# EAGLE design 64K SRAM Memory (EAGLE 7.5.0)
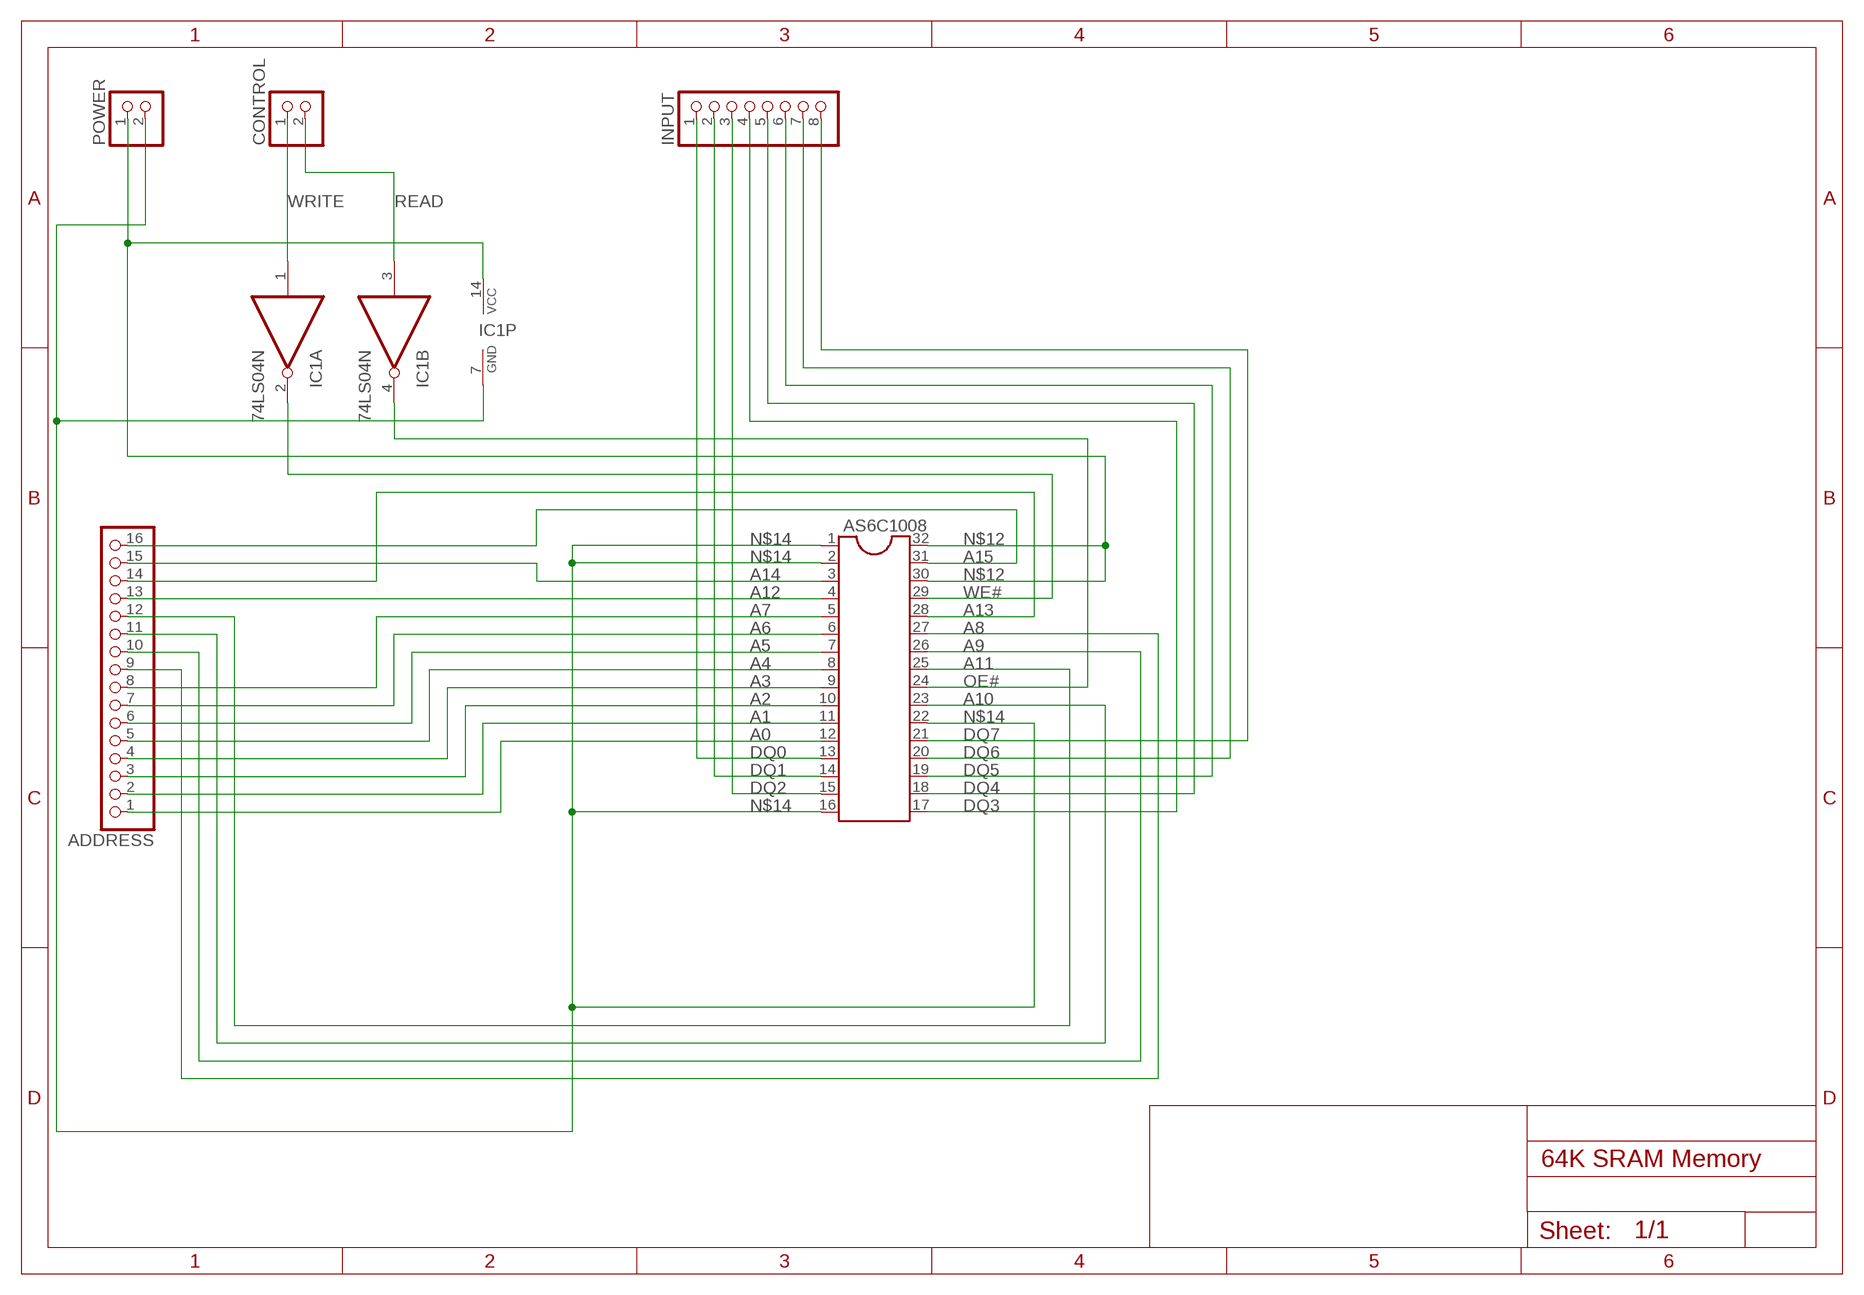
[diagram p0: schematic, sheet 1]

## Parts
ADDRESS  PINHD-1X16  [1X16]
AS6C1008  DIL32  [DIL32]
CONTROL  PINHD-1X2  [1X02]
IC1  74LS04N  [DIL14]
INPUT  PINHD-1X8  [1X08]
POWER  PINHD-1X2  [1X02]

## Nets
A0: ADDRESS.1 AS6C1008.12
A1: ADDRESS.2 AS6C1008.11
A2: ADDRESS.3 AS6C1008.10
A3: ADDRESS.4 AS6C1008.9
A4: ADDRESS.5 AS6C1008.8
A5: ADDRESS.6 AS6C1008.7
A6: ADDRESS.7 AS6C1008.6
A7: ADDRESS.8 AS6C1008.5
A8: ADDRESS.9 AS6C1008.27
A9: ADDRESS.10 AS6C1008.26
A10: ADDRESS.11 AS6C1008.23
A11: ADDRESS.12 AS6C1008.25
A12: ADDRESS.13 AS6C1008.4
A13: ADDRESS.14 AS6C1008.28
A14: ADDRESS.15 AS6C1008.3
A15: ADDRESS.16 AS6C1008.31
DQ0: AS6C1008.13 INPUT.1
DQ1: AS6C1008.14 INPUT.2
DQ2: AS6C1008.15 INPUT.3
DQ3: AS6C1008.17 INPUT.4
DQ4: AS6C1008.18 INPUT.5
DQ5: AS6C1008.19 INPUT.6
DQ6: AS6C1008.20 INPUT.7
DQ7: AS6C1008.21 INPUT.8
N$12: AS6C1008.30 AS6C1008.32 IC1.14(P:VCC) POWER.1
N$14: AS6C1008.1 AS6C1008.2 AS6C1008.16 AS6C1008.22 IC1.7(P:GND) POWER.2
OE#: AS6C1008.24 IC1.4(B:O)
READ: CONTROL.2 IC1.3(B:I)
WE#: AS6C1008.29 IC1.2(A:O)
WRITE: CONTROL.1 IC1.1(A:I)
Unconnected: IC1.5(C:I) IC1.6(C:O) IC1.8(D:O) IC1.9(D:I) IC1.10(E:O) IC1.11(E:I) IC1.12(F:O) IC1.13(F:I)

## Library data of the parts
ADDRESS = pinhead:PINHD-1X16: PIN HEADER
AS6C1008 = ic-package:DIL32: Dual In Line
CONTROL POWER = pinhead:PINHD-1X2: PIN HEADER
IC1 = 74xx-eu:74*04: Hex INVERTER
INPUT = pinhead:PINHD-1X8: PIN HEADER

## Board
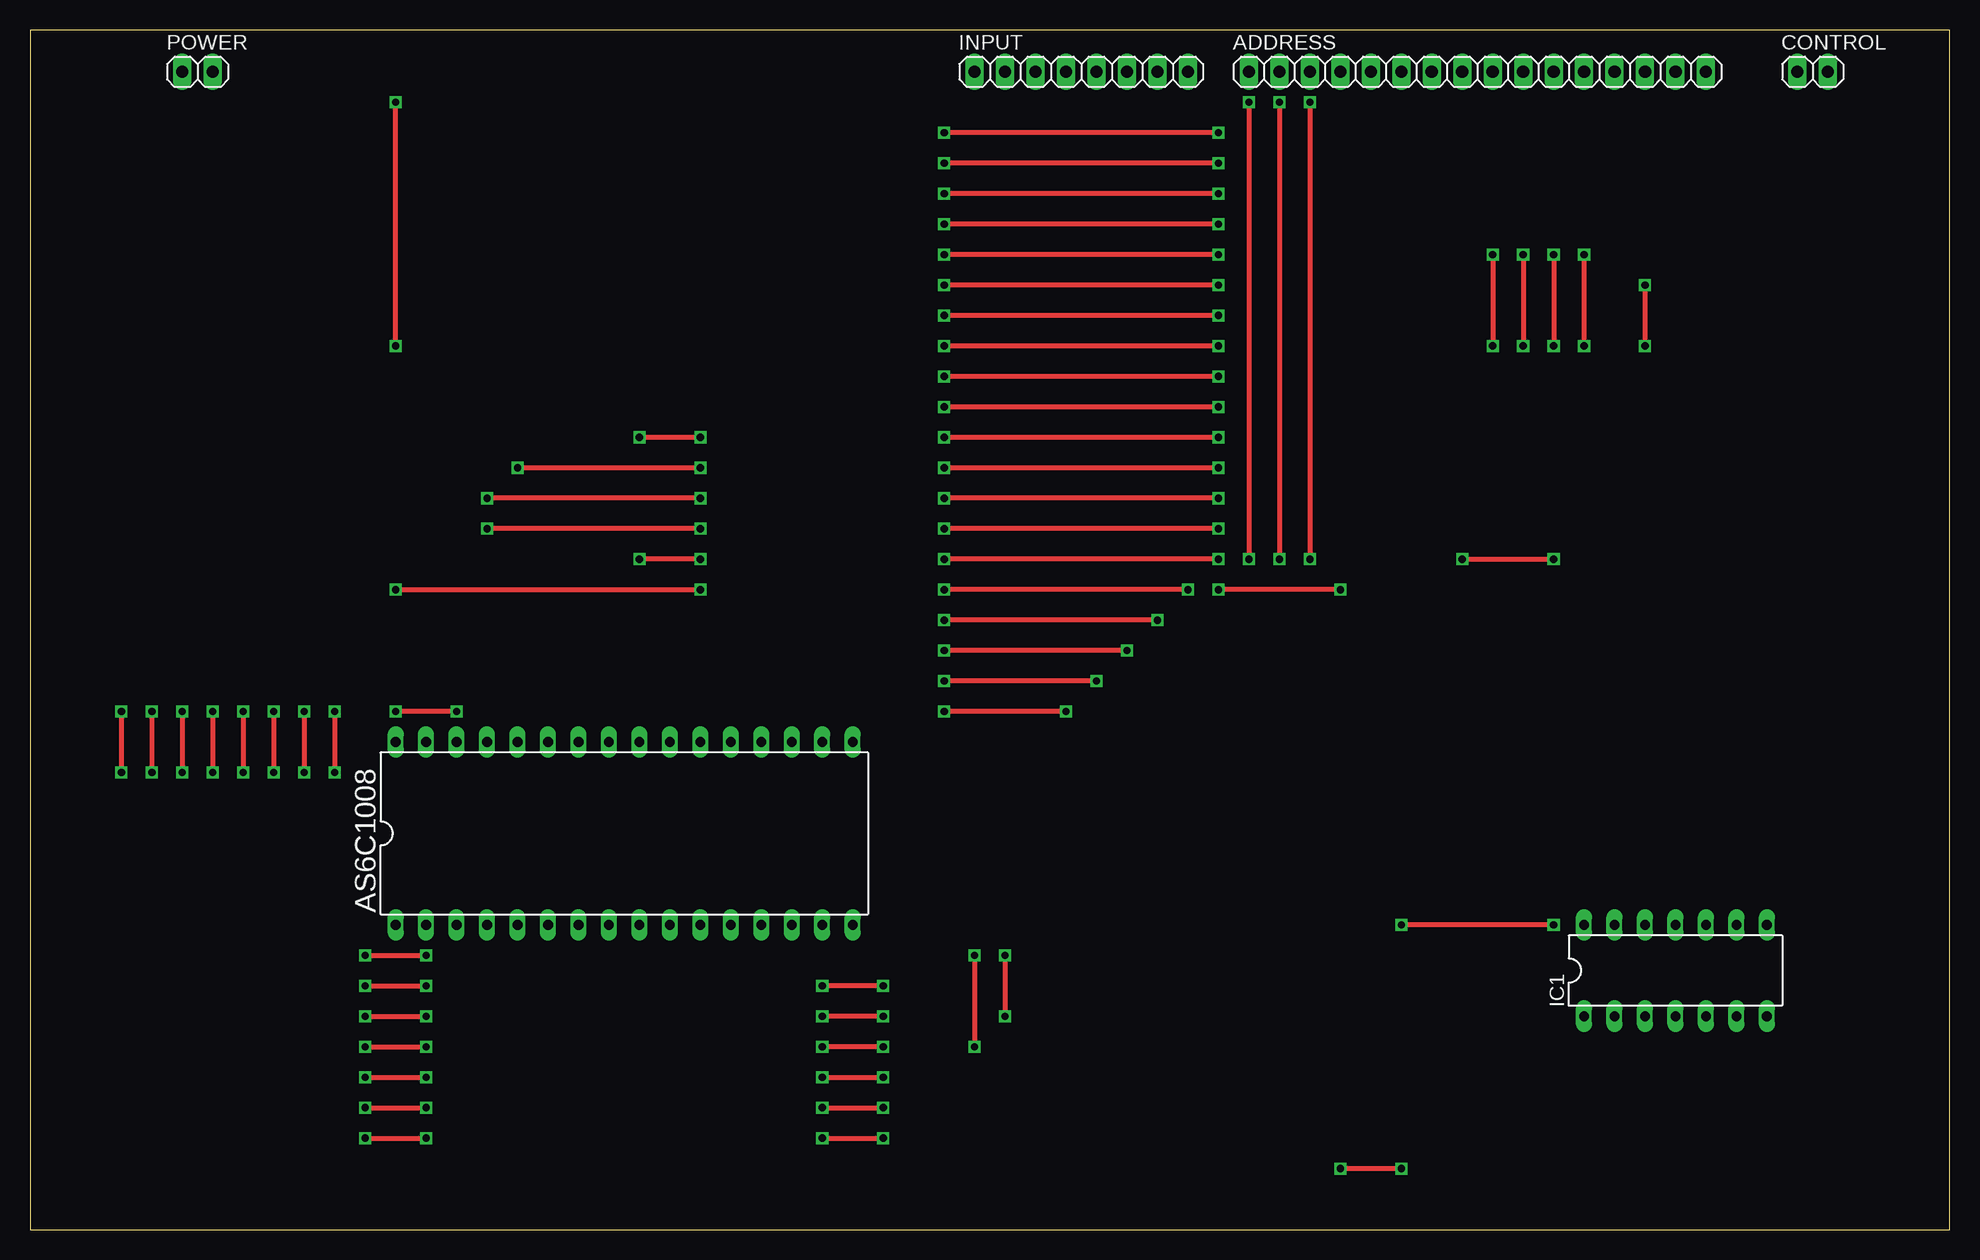
[diagram p1: board, top side]
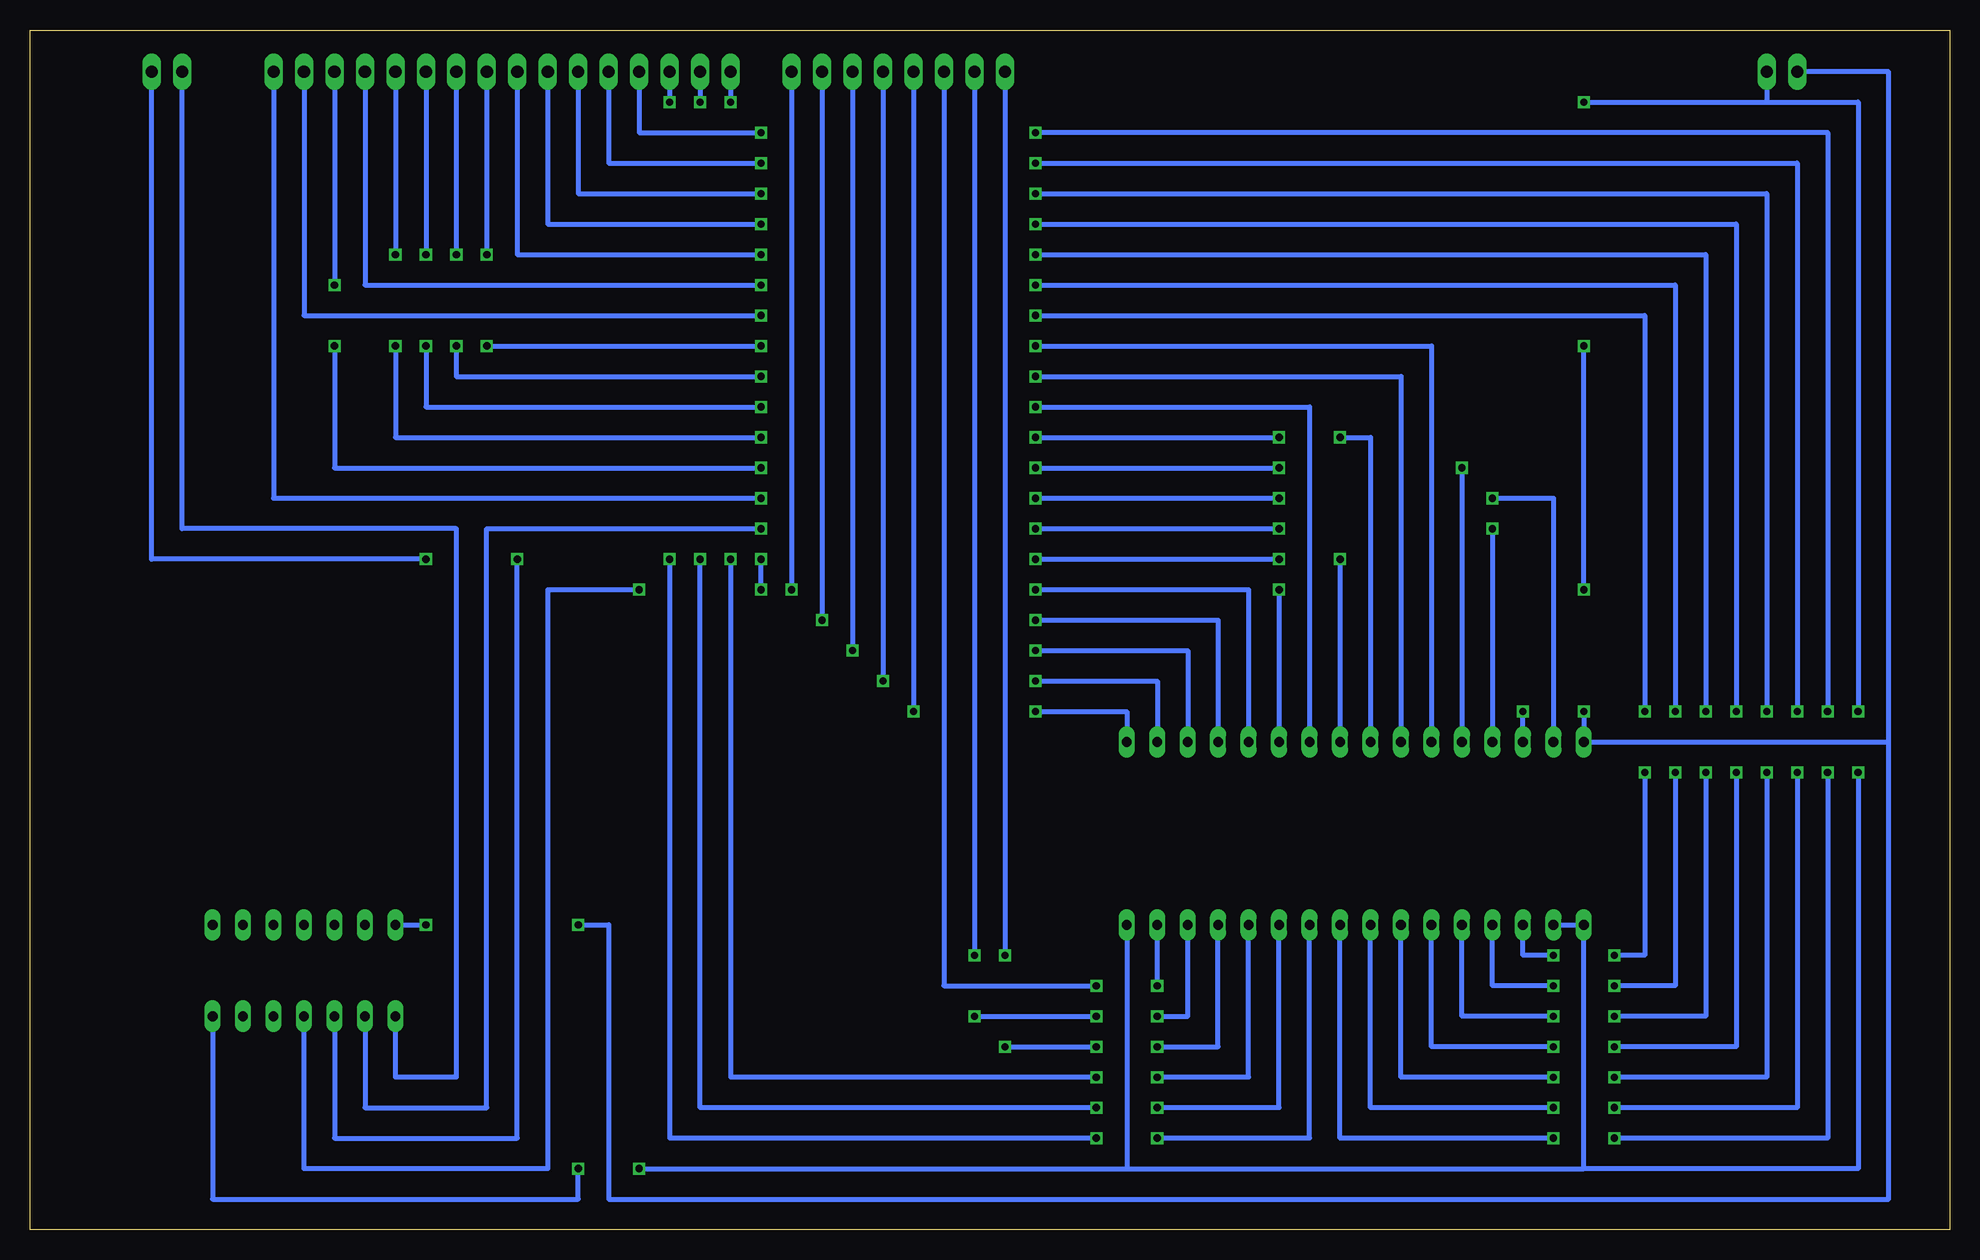
[diagram p2: board, bottom side, seen from below]

Size 160 x 100 mm. Coordinates in mm from the lower left corner, seen from the top.
Outline: 0,0 160,0 160,100 0,100 0,0
Copper layers (1*16): Top 0.035mm / dielectric 1.5mm / Bottom 0.035mm
Design rules "default": minimum track width 10mil, minimum drill 24mil, track to track 8mil, track to pad 8mil, pad to pad 8mil, via to via 8mil, smd to smd 8mil, copper to edge 40mil, drill to drill 8mil, minimum pad ring 10mil, minimum via ring 8mil, stop-mask expansion 4mil, vias tented up to drill 0mil, thermal gap 10mil

### Footprints (pad centres in the part's own frame; a part is rotated, then mirrored left to right if it is on the bottom)
1X16 = drill 1.016 long: 1 -19.05,0; 2 -16.51,0; 3 -13.97,0; 4 -11.43,0; 5 -8.89,0; 6 -6.35,0; 7 -3.81,0; 8 -1.27,0; 9 1.27,0; 10 3.81,0; 11 6.35,0; 12 8.89,0; 13 11.43,0; 14 13.97,0; 15 16.51,0; 16 19.05,0
DIL32 = drill 0.813 long: 1 -19.05,-7.62; 2 -16.51,-7.62; 3 -13.97,-7.62; 4 -11.43,-7.62; 5 -8.89,-7.62; 6 -6.35,-7.62; 7 -3.81,-7.62; 8 -1.27,-7.62; 9 1.27,-7.62; 10 3.81,-7.62; 11 6.35,-7.62; 12 8.89,-7.62; 13 11.43,-7.62; 14 13.97,-7.62; 15 16.51,-7.62; 16 19.05,-7.62; 17 19.05,7.62; 18 16.51,7.62; 19 13.97,7.62; 20 11.43,7.62; 21 8.89,7.62; 22 6.35,7.62; 23 3.81,7.62; 24 1.27,7.62; 25 -1.27,7.62; 26 -3.81,7.62; 27 -6.35,7.62; 28 -8.89,7.62; 29 -11.43,7.62; 30 -13.97,7.62; 31 -16.51,7.62; 32 -19.05,7.62
1X02 = drill 1.016 long: 1 -1.27,0; 2 1.27,0
DIL14 = drill 0.813 long: 1 -7.62,-3.81; 2 -5.08,-3.81; 3 -2.54,-3.81; 4 0,-3.81; 5 2.54,-3.81; 6 5.08,-3.81; 7 7.62,-3.81; 8 7.62,3.81; 9 5.08,3.81; 10 2.54,3.81; 11 0,3.81; 12 -2.54,3.81; 13 -5.08,3.81; 14 -7.62,3.81
1X08 = drill 1.016 long: 1 -8.89,0; 2 -6.35,0; 3 -3.81,0; 4 -1.27,0; 5 1.27,0; 6 3.81,0; 7 6.35,0; 8 8.89,0

### Placement (x,y rotation side)
ADDRESS  120.65,96.52 0 top
AS6C1008  49.53,33.02 0 top
CONTROL  148.59,96.52 0 top
IC1  137.16,21.59 0 top
INPUT  87.63,96.52 0 top
POWER  13.97,96.52 0 top

### Tracks (layer width: path | path; a pad name or v marks a point on that pad's centre or on a via)
A0  (via drill 0.6)
  Top 0.406: v101.6,93.98 v101.6,55.88 | v66.04,12.7 v71.12,12.7
  Bottom 0.406: ADDRESS.1 v101.6,93.98 | v101.6,55.88 101.6,12.7 v71.12,12.7 | AS6C1008.12 58.42,12.7 v66.04,12.7
A1  (via drill 0.6)
  Top 0.406: v104.14,93.98 v104.14,55.88 | v66.04,10.16 v71.12,10.16
  Bottom 0.406: ADDRESS.2 v104.14,93.98 | AS6C1008.11 55.88,10.16 v66.04,10.16 | v104.14,55.88 104.14,10.16 v71.12,10.16
A2  (via drill 0.6)
  Top 0.406: v106.68,93.98 v106.68,55.88 | v66.04,7.62 v71.12,7.62
  Bottom 0.406: ADDRESS.3 v106.68,93.98 | v106.68,55.88 106.68,7.62 v71.12,7.62 | AS6C1008.10 53.34,7.62 v66.04,7.62
A3  (via drill 0.6)
  Top 0.406: v99.06,91.44 v76.2,91.44 | v10.16,43.18 v10.16,38.1 | v27.94,7.62 v33.02,7.62
  Bottom 0.406: ADDRESS.4 109.22,91.44 v99.06,91.44 | v10.16,43.18 10.16,91.44 v76.2,91.44 | v10.16,38.1 10.16,7.62 v27.94,7.62 | AS6C1008.9 50.8,7.62 v33.02,7.62
A4  (via drill 0.6)
  Top 0.406: v99.06,88.9 v76.2,88.9 | v12.7,43.18 v12.7,38.1 | v27.94,10.16 v33.02,10.16
  Bottom 0.406: ADDRESS.5 111.76,88.9 v99.06,88.9 | v76.2,88.9 12.7,88.9 v12.7,43.18 | v12.7,38.1 12.7,10.16 v27.94,10.16 | v33.02,10.16 48.26,10.16 AS6C1008.8
A5  (via drill 0.6)
  Top 0.406: v99.06,86.36 v76.2,86.36 | v15.24,43.18 v15.24,38.1 | v27.94,12.7 v33.02,12.7
  Bottom 0.406: ADDRESS.6 114.3,86.36 v99.06,86.36 | v76.2,86.36 15.24,86.36 v15.24,43.18 | v15.24,38.1 15.24,12.7 v27.94,12.7 | v33.02,12.7 45.72,12.7 AS6C1008.7
A6  (via drill 0.6)
  Top 0.406: v99.06,83.82 v76.2,83.82 | v17.78,43.18 v17.78,38.1 | v27.94,15.24 v33.02,15.24
  Bottom 0.406: ADDRESS.7 116.84,83.82 v99.06,83.82 | v76.2,83.82 17.78,83.82 v17.78,43.18 | v17.78,38.1 17.78,15.24 v27.94,15.24 | v33.02,15.24 43.18,15.24 AS6C1008.6
A7  (via drill 0.6)
  Top 0.406: v99.06,81.28 v76.2,81.28 | v20.32,43.18 v20.32,38.1 | v27.94,17.78 v33.02,17.78
  Bottom 0.406: ADDRESS.8 119.38,81.28 v99.06,81.28 | v76.2,81.28 20.32,81.28 v20.32,43.18 | v20.32,38.1 20.32,17.78 v27.94,17.78 | v33.02,17.78 40.64,17.78 AS6C1008.5
A8  (via drill 0.6)
  Top 0.406: v99.06,73.66 v76.2,73.66 | v121.92,81.28 v121.92,73.66
  Bottom 0.406: v121.92,73.66 v99.06,73.66 | v76.2,73.66 43.18,73.66 AS6C1008.27 | ADDRESS.9 v121.92,81.28
A9  (via drill 0.6)
  Top 0.406: v99.06,71.12 v76.2,71.12 | v124.46,81.28 v124.46,73.66
  Bottom 0.406: v99.06,71.12 124.46,71.12 v124.46,73.66 | v76.2,71.12 45.72,71.12 AS6C1008.26 | ADDRESS.10 v124.46,81.28
A10  (via drill 0.6)
  Top 0.406: v127,81.28 v127,73.66 | v99.06,68.58 v76.2,68.58
  Bottom 0.406: ADDRESS.11 v127,81.28 | v127,73.66 127,68.58 v99.06,68.58 | v76.2,68.58 53.34,68.58 AS6C1008.23
A11  (via drill 0.6)
  Top 0.406: v129.54,81.28 v129.54,73.66 | v99.06,66.04 v76.2,66.04 | v55.88,66.04 v50.8,66.04
  Bottom 0.406: ADDRESS.12 v129.54,81.28 | v129.54,73.66 129.54,66.04 v99.06,66.04 | v76.2,66.04 v55.88,66.04 | v50.8,66.04 48.26,66.04 AS6C1008.25
A12  (via drill 0.6)
  Top 0.406: v99.06,78.74 v76.2,78.74 | v27.94,20.32 v33.02,20.32 | v22.86,43.18 v22.86,38.1
  Bottom 0.406: ADDRESS.13 132.08,78.74 v99.06,78.74 | v76.2,78.74 22.86,78.74 v22.86,43.18 | v27.94,20.32 22.86,20.32 v22.86,38.1 | v33.02,20.32 38.1,20.32 AS6C1008.4
A13  (via drill 0.6)
  Top 0.406: v134.62,78.74 v134.62,73.66 | v99.06,63.5 v76.2,63.5 | v55.88,63.5 v40.64,63.5
  Bottom 0.406: ADDRESS.14 v134.62,78.74 | v134.62,73.66 134.62,63.5 v99.06,63.5 | v76.2,63.5 v55.88,63.5 | v40.64,63.5 AS6C1008.28
A14  (via drill 0.6)
  Top 0.406: v99.06,76.2 v76.2,76.2 | v25.4,43.18 v25.4,38.1 | v27.94,22.86 v33.02,22.86
  Bottom 0.406: ADDRESS.15 137.16,76.2 v99.06,76.2 | v76.2,76.2 25.4,76.2 v25.4,43.18 | v25.4,38.1 25.4,22.86 v27.94,22.86 | v33.02,22.86 35.56,22.86 AS6C1008.3
A15  (via drill 0.6)
  Top 0.406: v99.06,60.96 v76.2,60.96 | v55.88,60.96 v38.1,60.96
  Bottom 0.406: ADDRESS.16 139.7,60.96 v99.06,60.96 | v76.2,60.96 v55.88,60.96 | v38.1,60.96 33.02,60.96 AS6C1008.31
DQ0  (via drill 0.6)
  Top 0.406: v78.74,22.86 v78.74,15.24 | v71.12,15.24 v66.04,15.24
  Bottom 0.406: INPUT.1 v78.74,22.86 | v78.74,15.24 v71.12,15.24 | v66.04,15.24 60.96,15.24 AS6C1008.13
DQ1  (via drill 0.6)
  Top 0.406: v81.28,22.86 v81.28,17.78 | v71.12,17.78 v66.04,17.78
  Bottom 0.406: INPUT.2 v81.28,22.86 | v81.28,17.78 v71.12,17.78 | v66.04,17.78 63.5,17.78 AS6C1008.14
DQ2  (via drill 0.6)
  Top 0.406: v71.12,20.32 v66.04,20.32
  Bottom 0.406: INPUT.3 83.82,20.32 v71.12,20.32 | v66.04,20.32 AS6C1008.15
DQ3  (via drill 0.6)
  Top 0.406: v86.36,43.18 v76.2,43.18
  Bottom 0.406: INPUT.4 v86.36,43.18 | v76.2,43.18 68.58,43.18 AS6C1008.17
DQ4  (via drill 0.6)
  Top 0.406: v88.9,45.72 v76.2,45.72
  Bottom 0.406: INPUT.5 v88.9,45.72 | v76.2,45.72 66.04,45.72 AS6C1008.18
DQ5  (via drill 0.6)
  Top 0.406: v91.44,48.26 v76.2,48.26
  Bottom 0.406: INPUT.6 v91.44,48.26 | v76.2,48.26 63.5,48.26 AS6C1008.19
DQ6  (via drill 0.6)
  Top 0.406: v93.98,50.8 v76.2,50.8
  Bottom 0.406: INPUT.7 v93.98,50.8 | v76.2,50.8 60.96,50.8 AS6C1008.20
DQ7  (via drill 0.6)
  Top 0.406: v96.52,53.34 v76.2,53.34
  Bottom 0.406: INPUT.8 v96.52,53.34 | v76.2,53.34 58.42,53.34 AS6C1008.21
N$12  (via drill 0.6)
  Top 0.406: v35.56,43.18 v30.48,43.18 | v127,25.4 v114.3,25.4
  Bottom 0.406: AS6C1008.30 v35.56,43.18 | v30.48,43.18 AS6C1008.32 5.08,40.64 | 5.08,40.64 5.08,2.54 111.76,2.54 111.76,25.4 v114.3,25.4 | 5.08,40.64 5.08,96.52 POWER.1 | IC1.14 v127,25.4
N$14  (via drill 0.6)
  Top 0.406: v7.62,43.18 v7.62,38.1 | v114.3,5.08 v109.22,5.08 | v30.48,73.66 v30.48,93.98 | v30.48,53.34 v55.88,53.34
  Bottom 0.406: AS6C1008.2 AS6C1008.1 30.48,5.08 | POWER.2 15.24,93.98 | 15.24,93.98 7.62,93.98 v7.62,43.18 | v7.62,38.1 7.62,5.08 30.48,5.08 | IC1.7 144.78,2.54 114.3,2.54 v114.3,5.08 | v109.22,5.08 68.58,5.08 | v30.48,53.34 v30.48,73.66 | v30.48,93.98 15.24,93.98 | AS6C1008.16 68.58,5.08 | 68.58,5.08 30.48,5.08 | v55.88,53.34 AS6C1008.22
OE#  (via drill 0.6)
  Top 0.406: v109.22,53.34 v99.06,53.34 | v99.06,55.88 v76.2,55.88 | v55.88,55.88 v50.8,55.88
  Bottom 0.406: IC1.4 137.16,5.08 116.84,5.08 116.84,53.34 v109.22,53.34 | v99.06,53.34 v99.06,55.88 | v76.2,55.88 v55.88,55.88 | v50.8,55.88 AS6C1008.24
READ  (via drill 0.6)
  Top 0.406: v119.38,55.88 v127,55.88
  Bottom 0.406: IC1.3 134.62,7.62 119.38,7.62 v119.38,55.88 | v127,55.88 149.86,55.88 CONTROL.2
WE#  (via drill 0.6)
  Top 0.406: v99.06,58.42 v76.2,58.42 | v55.88,58.42 v38.1,58.42
  Bottom 0.406: IC1.2 132.08,10.16 121.92,10.16 121.92,58.42 v99.06,58.42 | v76.2,58.42 v55.88,58.42 | v38.1,58.42 AS6C1008.29
WRITE
  Bottom 0.406: CONTROL.1 147.32,58.42 124.46,58.42 124.46,12.7 129.54,12.7 IC1.1